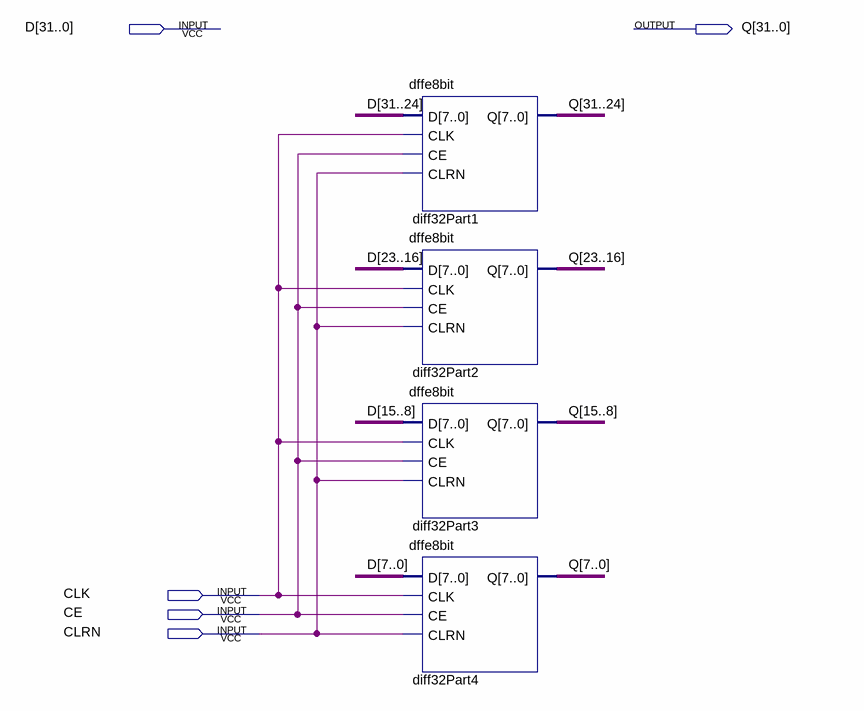
[diagram p0: schematic sheet]
// Quartus schematic dffe32bit.bdf as structural Verilog: 4 symbols, 5 pins
module dffe32bit (
  input  [31:0] D,
  input  CLK,
  input  CE,
  input  CLRN,
  output [31:0] Q
);

  dffe8bit diff32Part1 (.D(D[31:24]), .CLK(CLK), .CE(CE), .CLRN(CLRN), .Q(Q[31:24]));
  dffe8bit diff32Part2 (.D(D[23:16]), .CLK(CLK), .CE(CE), .CLRN(CLRN), .Q(Q[23:16]));
  dffe8bit diff32Part3 (.D(D[15:8]), .CLK(CLK), .CE(CE), .CLRN(CLRN), .Q(Q[15:8]));
  dffe8bit diff32Part4 (.D(D[7:0]), .CLK(CLK), .CE(CE), .CLRN(CLRN), .Q(Q[7:0]));
endmodule
